# Altium schematic sheet 2017_CARTE_MOFSET.SchDoc
size A4
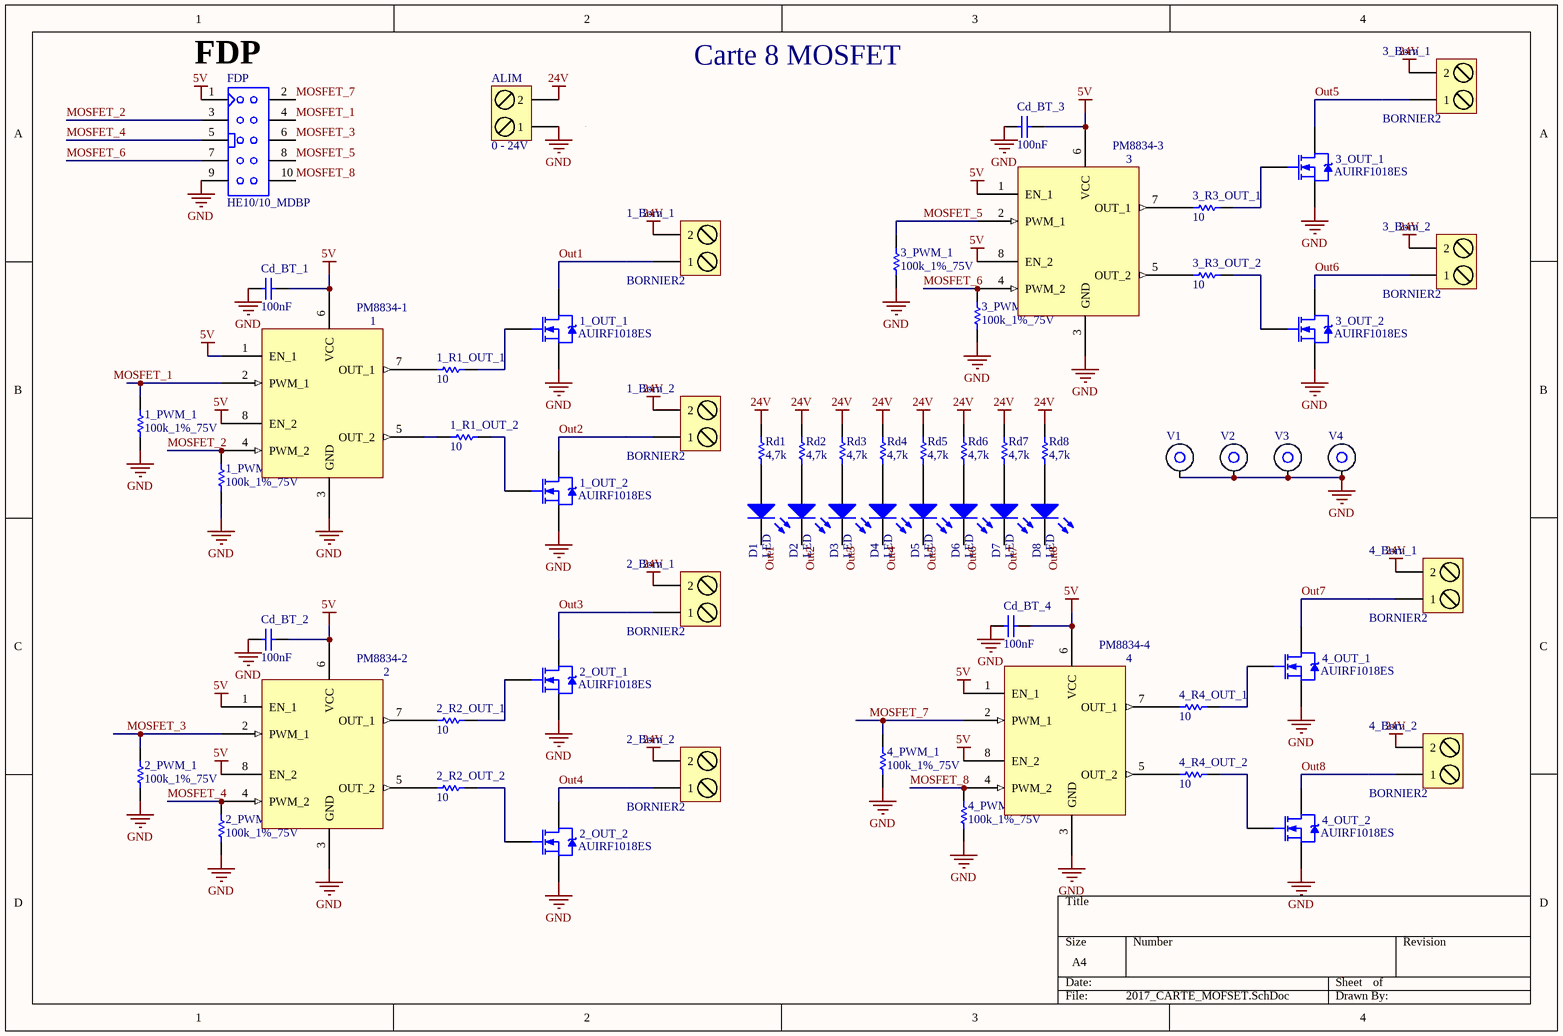
[diagram p0: 2017_CARTE_MOFSET.SchDoc]

## Parts
1  PM8834-1  [SO8_N]
1_Born_1  BORNIER2  [BORNIER2]
1_Born_2  BORNIER2  [BORNIER2]
1_OUT_1  AUIRF1018ES  [D2PAK_GROS_PAD]
1_OUT_2  AUIRF1018ES  [D2PAK_GROS_PAD]
1_PWM_1  100k_1%_75V  [R1206_N]
1_PWM_2  100k_1%_75V  [R1206_N]
1_R1_OUT_1  10  [R1206_N]
1_R1_OUT_2  10  [R1206_N]
2  PM8834-2  [SO8_N]
2_Born_1  BORNIER2  [BORNIER2]
2_Born_2  BORNIER2  [BORNIER2]
2_OUT_1  AUIRF1018ES  [D2PAK_GROS_PAD]
2_OUT_2  AUIRF1018ES  [D2PAK_GROS_PAD]
2_PWM_1  100k_1%_75V  [R1206_N]
2_PWM_2  100k_1%_75V  [R1206_N]
2_R2_OUT_1  10  [R1206_N]
2_R2_OUT_2  10  [R1206_N]
3  PM8834-3  [SO8_N]
3_Born_1  BORNIER2  [BORNIER2]
3_Born_2  BORNIER2  [BORNIER2]
3_OUT_1  AUIRF1018ES  [D2PAK_GROS_PAD]
3_OUT_2  AUIRF1018ES  [D2PAK_GROS_PAD]
3_PWM_1  100k_1%_75V  [R1206_N]
3_PWM_2  100k_1%_75V  [R1206_N]
3_R3_OUT_1  10  [R1206_N]
3_R3_OUT_2  10  [R1206_N]
4  PM8834-4  [SO8_N]
4_Born_1  BORNIER2  [BORNIER2]
4_Born_2  BORNIER2  [BORNIER2]
4_OUT_1  AUIRF1018ES  [D2PAK_GROS_PAD]
4_OUT_2  AUIRF1018ES  [D2PAK_GROS_PAD]
4_PWM_1  100k_1%_75V  [R1206_N]
4_PWM_2  100k_1%_75V  [R1206_N]
4_R4_OUT_1  10  [R1206_N]
4_R4_OUT_2  10  [R1206_N]
ALIM  0 - 24V  [BORNIER2_FEM_COUDE]
Cd_BT_1  100nF  [C0805_N]
Cd_BT_2  100nF  [C0805_N]
Cd_BT_3  100nF  [C0805_N]
Cd_BT_4  100nF  [C0805_N]
D1  LED  [LED_0805]
D2  LED  [LED_0805]
D3  LED  [LED_0805]
D4  LED  [LED_0805]
D5  LED  [LED_0805]
D6  LED  [LED_0805]
D7  LED  [LED_0805]
D8  LED  [LED_0805]
FDP  Type: HE10/10_MDBP  [HE10/10_M_D_BP]  (hidden comment: HE10/10_MALE_DROIT_BAS_PROFIL)
Rd1  4,7k  [R1206_N]
Rd2  4,7k  [R1206_N]
Rd3  4,7k  [R1206_N]
Rd4  4,7k  [R1206_N]
Rd5  4,7k  [R1206_N]
Rd6  4,7k  [R1206_N]
Rd7  4,7k  [R1206_N]
Rd8  4,7k  [R1206_N]
V1  Entretoise WURTH CMS  [ENTRETOISE_CMS]  (value not drawn)
V2  Entretoise WURTH CMS  [ENTRETOISE_CMS]  (value not drawn)
V3  Entretoise WURTH CMS  [ENTRETOISE_CMS]  (value not drawn)
V4  Entretoise WURTH CMS  [ENTRETOISE_CMS]  (value not drawn)

## Nets
5V: 1.1(EN_1) 1.6(VCC) 1.8(EN_2) 2.1(EN_1) 2.6(VCC) 2.8(EN_2) 3.1(EN_1) 3.6(VCC) 3.8(EN_2) 4.1(EN_1) 4.6(VCC) 4.8(EN_2) Cd_BT_1.2 Cd_BT_2.2 Cd_BT_3.2 Cd_BT_4.2 FDP.1
24V: 1_Born_1.2 1_Born_2.2 2_Born_1.2 2_Born_2.2 3_Born_1.2 3_Born_2.2 4_Born_1.2 4_Born_2.2 ALIM.2 Rd1.1 Rd2.1 Rd3.1 Rd4.1 Rd5.1 Rd6.1 Rd7.1 Rd8.1
GND: 1.3(GND) 1_OUT_1.3(S) 1_OUT_2.3(S) 1_PWM_1.1 1_PWM_2.1 2.3(GND) 2_OUT_1.3(S) 2_OUT_2.3(S) 2_PWM_1.1 2_PWM_2.1 3.3(GND) 3_OUT_1.3(S) 3_OUT_2.3(S) 3_PWM_1.1 3_PWM_2.1 4.3(GND) 4_OUT_1.3(S) 4_OUT_2.3(S) 4_PWM_1.1 4_PWM_2.1 ALIM.1 Cd_BT_1.1 Cd_BT_2.1 Cd_BT_3.1 Cd_BT_4.1 FDP.9 V1.1 V2.1 V3.1 V4.1
MOSFET_1: FDP.4
MOSFET_2: 1.4(PWM_2) 1_PWM_2.2 FDP.3
MOSFET_3: 2.2(PWM_1) 2_PWM_1.2 FDP.6
MOSFET_4: 2.4(PWM_2) 2_PWM_2.2 FDP.5
MOSFET_5: 3.2(PWM_1) 3_PWM_1.2 FDP.8
MOSFET_6: 3.4(PWM_2) 3_PWM_2.2 FDP.7
MOSFET_7: 4.2(PWM_1) 4_PWM_1.2 FDP.2
MOSFET_8: 4.4(PWM_2) 4_PWM_2.2 FDP.10
Out1: 1_Born_1.1 1_OUT_1.2(D) D1.2(K)
Out2: 1_Born_2.1 1_OUT_2.2(D) D2.2(K)
Out3: 2_Born_1.1 2_OUT_1.2(D) D3.2(K)
Out4: 2_Born_2.1 2_OUT_2.2(D) D4.2(K)
Out5: 3_Born_1.1 3_OUT_1.2(D) D5.2(K)
Out6: 3_Born_2.1 3_OUT_2.2(D) D6.2(K)
Out7: 4_Born_1.1 4_OUT_1.2(D) D7.2(K)
Out8: 4_Born_2.1 4_OUT_2.2(D) D8.2(K)
Net1_2: 1.2(PWM_1) 1_PWM_1.2
Net1_5: 1.5(OUT_2) 1_R1_OUT_2.1
Net1_7: 1.7(OUT_1) 1_R1_OUT_1.1
Net1_OUT_1_1: 1_OUT_1.1(G) 1_R1_OUT_1.2
Net1_OUT_2_1: 1_OUT_2.1(G) 1_R1_OUT_2.2
Net2_5: 2.5(OUT_2) 2_R2_OUT_2.1
Net2_7: 2.7(OUT_1) 2_R2_OUT_1.1
Net2_OUT_1_1: 2_OUT_1.1(G) 2_R2_OUT_1.2
Net2_OUT_2_1: 2_OUT_2.1(G) 2_R2_OUT_2.2
Net3_5: 3.5(OUT_2) 3_R3_OUT_2.1
Net3_7: 3.7(OUT_1) 3_R3_OUT_1.1
Net3_OUT_1_1: 3_OUT_1.1(G) 3_R3_OUT_1.2
Net3_OUT_2_1: 3_OUT_2.1(G) 3_R3_OUT_2.2
Net4_5: 4.5(OUT_2) 4_R4_OUT_2.1
Net4_7: 4.7(OUT_1) 4_R4_OUT_1.1
Net4_OUT_1_1: 4_OUT_1.1(G) 4_R4_OUT_1.2
Net4_OUT_2_1: 4_OUT_2.1(G) 4_R4_OUT_2.2
NetD1_1: D1.1(A) Rd1.2
NetD2_1: D2.1(A) Rd2.2
NetD3_1: D3.1(A) Rd3.2
NetD4_1: D4.1(A) Rd4.2
NetD5_1: D5.1(A) Rd5.2
NetD6_1: D6.1(A) Rd6.2
NetD7_1: D7.1(A) Rd7.2
NetD8_1: D8.1(A) Rd8.2

## Notes on the sheet
- (near FDP) FDP
- Carte 8 MOSFET
- Labels drawn without touching a wire or pin: MOSFET_1

## Library data of the parts
1-4 = PM8834: 4 A dual low-side MOSFET driver
1_Born_1 1_Born_2 2_Born_1 2_Born_2 3_Born_1 3_Born_2 4_Born_1 4_Born_2 ALIM = BORNIER2: Terminal blocks, 2 pins, pitch=5mm
1_OUT_1 1_OUT_2 2_OUT_1 2_OUT_2 3_OUT_1 3_OUT_2 4_OUT_1 4_OUT_2 = IRF1010S: HEXFET N-Channel Power MOSFET; Published: 8-Jun-2000; LatestRevisionDate: 17-Jul-2002; LatestRevisionNote: Re-released for DXP Platform.; DatasheetVersion: PD-9.923; PackageReference: D2PAK; Publisher: Altium Limited; PackageDescription: D2-PAK/TO-263-AB; 3 Leads (1 Cropped); Body 15.5 (inc. leads) x 10.5 mm (LxW max); ComponentLink1Description: Manufacturer Link; ComponentLink1URL: http://www.irf.com/; ComponentLink2Description: Datasheet; ComponentLink2URL: http://www.irf.com/product-info/datasheets/data/irf1010ns.pdf
1_PWM_1 1_PWM_2 2_PWM_1 2_PWM_2 3_PWM_1 3_PWM_2 4_PWM_1 4_PWM_2 = Resistor: FAR: 1469748; Published: 8-Jun-2000; LatestRevisionDate: 17-Jul-2002; LatestRevisionNote: Re-released for DXP Platform.; PackageReference: AXIAL-0.5; Publisher: Altium Limited
1_R1_OUT_1 1_R1_OUT_2 2_R2_OUT_1 2_R2_OUT_2 3_R3_OUT_1 3_R3_OUT_2 4_R4_OUT_1 4_R4_OUT_2 Rd1-Rd8 = Resistor: Published: 8-Jun-2000; LatestRevisionDate: 17-Jul-2002; LatestRevisionNote: Re-released for DXP Platform.; PackageReference: AXIAL-0.5; Publisher: Altium Limited
Cd_BT_1-Cd_BT_4 = Condensateur: Capacitor; Published: 8-Jun-2000; LatestRevisionDate: 17-Jul-2002; LatestRevisionNote: Re-released for DXP Platform.; PackageReference: RAD-0.3; Publisher: Altium Limited
D1-D8 = LED: Typical LED; Published: 8-Jun-2000; LatestRevisionDate: 08-Jul-2005; LatestRevisionNote: Mech Layer 1 removed.; PackageReference: LED-1; Publisher: Altium Limited
FDP = HE10/10_MALE_DROIT_BAS_PROFIL: EMBASE HE10/10 MALE DROIT BAS PROFIL
V1-V4 = Entretoise WURTH CMS: Entretoise Wurth; Publisher: Damien Guitton